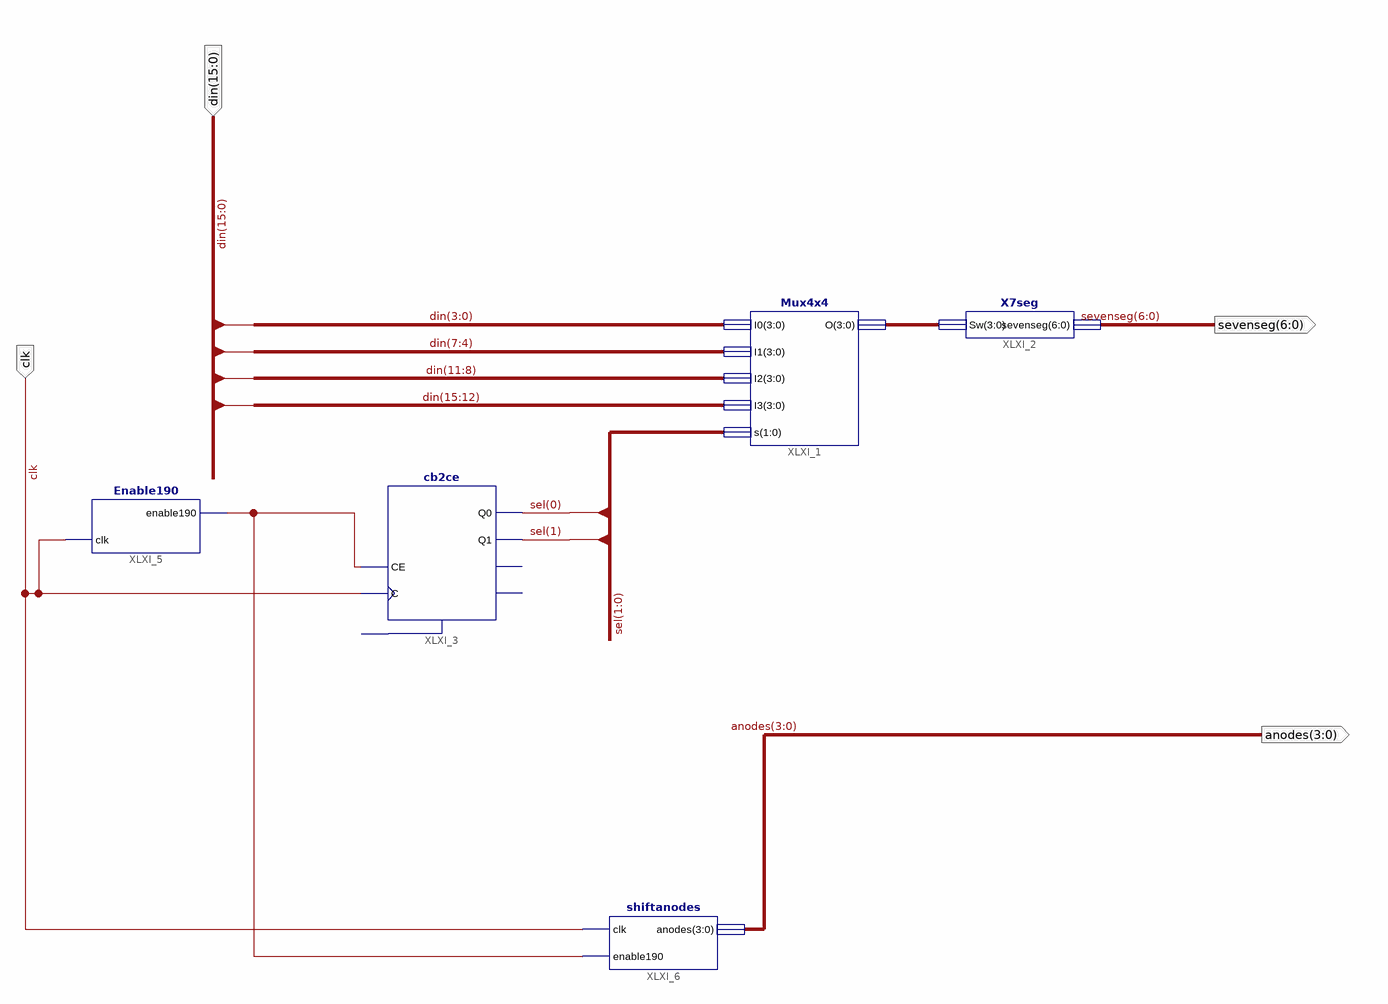
[diagram p0: schematic sheet 1]
// Xilinx ISE schematic afficheur.sch (spartan6) as structural Verilog: 5 symbols, 4 ports
module afficheur (
  input  [15:0] din,
  input  clk,
  output [6:0] sevenseg,
  output [3:0] anodes
);

  wire XLXN_16;
  wire [1:0] sel;
  wire [3:0] XLXN_2;

  Mux4x4 XLXI_1 (.I0(din[3:0]), .I1(din[7:4]), .I2(din[11:8]), .I3(din[15:12]), .s(sel), .O(XLXN_2));
  X7seg XLXI_2 (.Sw(XLXN_2), .sevenseg(sevenseg));
  cb2ce XLXI_3 (.C(clk), .CE(XLXN_16), .Q0(sel[0]), .Q1(sel[1]));  // open: CLR, CEO, TC
  Enable190 XLXI_5 (.enable190(XLXN_16), .clk(clk));
  shiftanodes XLXI_6 (.clk(clk), .enable190(XLXN_16), .anodes(anodes));
endmodule
